# EAGLE design Circuit (EAGLE 9.6.2)
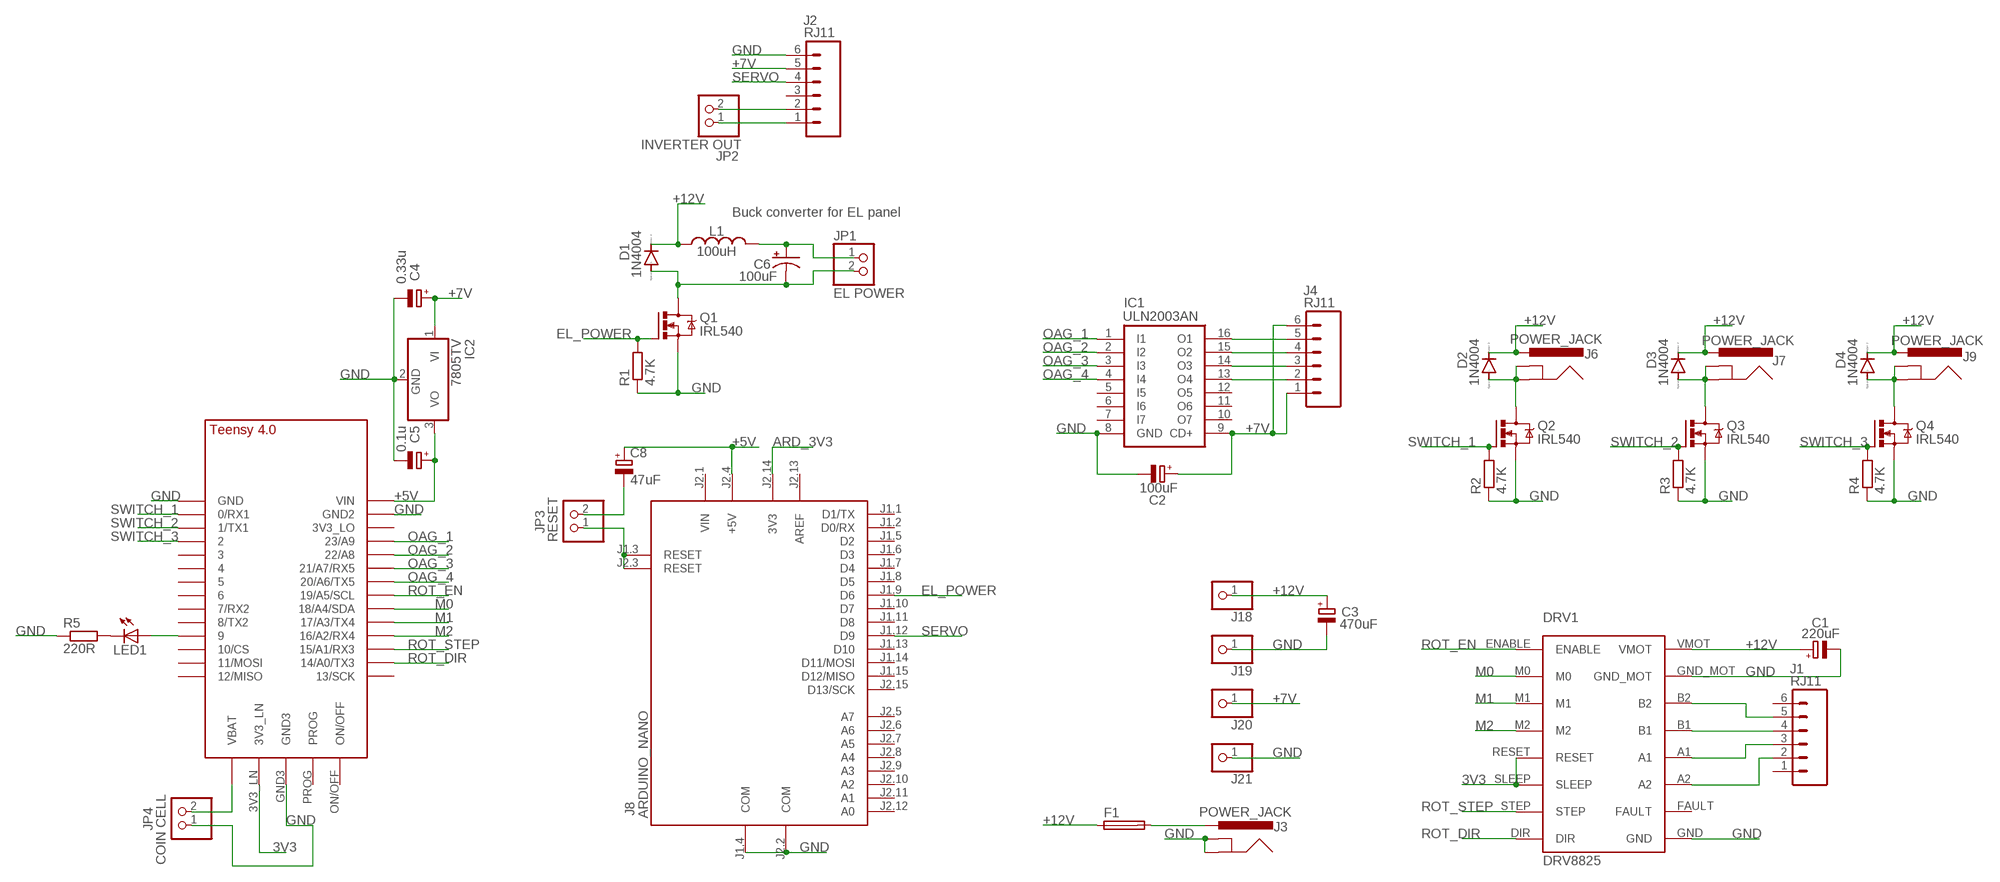
[diagram p0: schematic, sheet 1]

## Parts
C1  220uF  CPOL-EUE3.5-8  [E3,5-8]
C2  100uF  CPOL-EUE2.5-6  [E2,5-6]
C3  470uF  CPOL-EUE3.5-8  [E3,5-8]
C4  0.33u  CPOL-EUE1.8-4  [E1,8-4]
C5  0.1u  CPOL-EUE1.8-4  [E1,8-4]
C6  100uF  CPOL-USE2.5-7  [E2,5-7]
C8  47uF  CPOL-EUE2,5-6E  [E2,5-6E]
D1  1N4004  [DO41-10]
D2  1N4004  [DO41-10]
D3  1N4004  [DO41-10]
D4  1N4004  [DO41-10]
DRV1  DRV8825  [DRV8825]
F1  SH22,5  [SH22,5]
IC1  ULN2003AN  [DIL16]
IC2  7805TV  [TO220V]
J1  RJ11  RJ11-6  [RJ11-6]
J2  RJ11  RJ11-6  [RJ11-6]
J3  POWER_JACK  [POWER_JACK_PTH]
J4  RJ11  RJ11-6  [RJ11-6]
J6  POWER_JACK  [POWER_JACK_PTH]
J7  POWER_JACK  [POWER_JACK_PTH]
J8  ARDUINO_NANO  ARDUINO_NANO2  [ARDUINO_NANO2]
J9  POWER_JACK  [POWER_JACK_PTH]
J18  PINHD-1X1  [1X01]
J19  PINHD-1X1  [1X01]
J20  PINHD-1X1  [1X01]
J21  PINHD-1X1  [1X01]
JP1  EL POWER  PINHD-1X2  [1X02]
JP2  INVERTER OUT  PINHD-1X2  [1X02]
JP3  RESET  PINHD-1X2  [1X02]
JP4  COIN CELL  PINHD-1X2  [1X02]
L1  100uH  L-US6000-XXX-RC  [6000-XXXX-RC]
LED1  LED3MM  [LED3MM]
Q1  IRL540  IRF540  [TO220BV]
Q2  IRL540  IRF540  [TO220BV]
Q3  IRL540  IRF540  [TO220BV]
Q4  IRL540  IRF540  [TO220BV]
R1  4.7K  R-EU_0204/7  [0204/7]
R2  4.7K  R-EU_0204/7  [0204/7]
R3  4.7K  R-EU_0204/7  [0204/7]
R4  4.7K  R-EU_0204/7  [0204/7]
R5  220R  R-EU_0204/5  [0204/5]
U$1  TEENSY_4.0-BASIC  [TEENSY_4.0-BASIC]

## Nets
3V3: DRV1.RESET DRV1.SLEEP U$1.3V3_LN
+5V: C5.+ C8.+ IC2.3(VO) J8.J2.4(+5V) U$1.VIN
+7V: C2.+ C4.+ IC1.9(CD+) IC2.1(VI) J2.5 J4.1 J4.6 J20.1
+12V: C1.+ C3.+ D1.C D2.C D3.C D4.C DRV1.VMOT F1.1 J6.PWR J7.PWR J9.PWR J18.1 L1.1
ARD_3V3: J8.J2.14(3V3)
EL_POWER: J8.J1.9(D6) Q1.G R1.2
GND: C1.- C2.- C3.- C4.- C5.- DRV1.GND DRV1.GND_MOT IC1.8(GND) IC2.2(GND) J2.6 J3.GND J3.GNDBREAK J8.J1.4(COM) J8.J2.2(COM) J19.1 J21.1 JP4.1 Q1.S Q2.S Q3.S Q4.S R1.1 R2.1 R3.1 R4.1 R5.1 U$1.GND U$1.GND2 U$1.GND3
M0: DRV1.M0 U$1.18/A4/SDA
M1: DRV1.M1 U$1.17/A3(17/A3/TX4)
M2: DRV1.M2 U$1.16/A2(16/A2/RX4)
N$1: DRV1.B1 J1.4
N$2: D3.A J7.GND J7.GNDBREAK Q3.D
N$3: C6.- D1.A JP1.2 Q1.D
N$4: D4.A J9.GND J9.GNDBREAK Q4.D
N$5: D2.A J6.GND J6.GNDBREAK Q2.D
N$6: DRV1.B2 J1.5
N$7: IC1.16(O1) J4.5
N$8: DRV1.A1 J1.3
N$9: DRV1.A2 J1.2
N$10: LED1.A U$1.9/CS
N$11: LED1.K(C) R5.2
N$12: C6.+ JP1.1 L1.2
N$13: J2.1 JP2.1
N$14: J2.2 JP2.2
N$15: JP4.2 U$1.VBAT\(VBAT)
N$16: IC1.15(O2) J4.4
N$17: IC1.14(O3) J4.3
N$18: IC1.13(O4) J4.2
N$19: J8.J1.3(RESET) J8.J2.3(RESET) JP3.1
N$23: C8.- JP3.2
N$25: F1.2 J3.PWR
OAG_1: IC1.1(I1) U$1.23/A9
OAG_2: IC1.2(I2) U$1.22/A8
OAG_3: IC1.3(I3) U$1.21/A7(21/A7/RX5)
OAG_4: IC1.4(I4) U$1.20/A6(20/A6/TX5)
ROT_DIR: DRV1.DIR U$1.14/A0(14/A0/TX3)
ROT_EN: DRV1.ENABLE U$1.19/A5/SCL
ROT_STEP: DRV1.STEP U$1.15/A1(15/A1/RX3)
SERVO: J2.4 J8.J1.12(D9)
SWITCH_1: Q2.G R2.2 U$1.0/RX(0/RX1)
SWITCH_2: Q3.G R3.2 U$1.1/TX(1/TX1)
SWITCH_3: Q4.G R4.2 U$1.2
Unconnected: DRV1.FAULT IC1.5(I5) IC1.6(I6) IC1.7(I7) IC1.10(O7) IC1.11(O6) IC1.12(O5) J1.1 J1.6 J2.3 J8.J1.1(D1/TX) J8.J1.2(D0/RX) J8.J1.5(D2) J8.J1.6(D3) J8.J1.7(D4) J8.J1.8(D5) J8.J1.10(D7) J8.J1.11(D8) J8.J1.13(D10) J8.J1.14(D11/MOSI) J8.J1.15(D12/MISO) J8.J2.5(A7) J8.J2.6(A6) J8.J2.7(A5) J8.J2.8(A4) J8.J2.9(A3) J8.J2.10(A2) J8.J2.11(A1) J8.J2.12(A0) J8.J2.15(D13/SCK) U$1.3/CANTX U$1.3V3_LO U$1.4/CANRX U$1.5 U$1.6 U$1.7(7/RX2) U$1.8(8/TX2) U$1.10/CS U$1.11/MOSI U$1.12/MISO U$1.13/SCK U$1.ON/OFF U$1.PROG

## Notes on the sheet
- Buck converter for EL panel

## Power pins joined to a net without a drawn wire
AREF: J8.J2.13(AREF)
VIN: J8.J2.1(VIN)

## Library data of the parts
C1-C5 C8 = rcl:CPOL-EU: POLARIZED CAPACITOR, European symbol; SPICEPREFIX: C
C6 = rcl:CPOL-US: POLARIZED CAPACITOR, American symbol; SPICEPREFIX: C
D1-D4 = diode:1N4004: DIODE general purpose rectifier, 1 A
DRV1 = DRV8825:DRV8825: DRV8825 Stepper motor driver
F1 = fuse:SH22,5: FUSE HOLDER grid 22,5 mm, OGN0031 8201, Schurter (Buerklin); MF: SCHURTER; MPN: 0031.8201; OC_FARNELL: 1162740; OC_NEWARK: 96F8317
IC1 = uln-udn:ULN2003A: DRIVER ARRAY
IC2 = linear:78*: Positive VOLTAGE REGULATOR Source: http://cache.national.com/ds/LM/LM78L05.pdf http://www.fairchildsemi.com/ds/LM/LM7805.pdf
J1 J2 J4 = SparkFun-Connectors:RJ11-6: RJ11 Jack - 6 pin Commonly found on CAT3 devices and some Microchip programmers. Here is the connector we sell at SparkFun: RJ11 6-Pin Connector <https://www.sparkfun.com/products/132> (PRT-00132) Datasheet <http://www.sparkfun.com/datasheets/Prototyping/Connectors/RJ11-Datasheet.pdf> It is used on this SparkFun product: SparkFun Weather Shield <https://www.sparkfun.com/products/12081> (DEV-12081) Weather Meters <https://www.sparkfun.com/products/8942> (SEN-08942); PROD_ID: CONN-08590; SF_ID: PRT-00132
J3 J6 J7 J9 = SparkFun-Connectors:POWER_JACK: Power Jack Connector This is the standard 5.5mm barrel jack for power. The PTH is the most common, proven, reliable, footprint. The Slot footprint only works if the mill layer is transmitted to the PCB fab house so be warned. Here are the connectors we sell at SparkFun: DC Barrel Power Jack/Connector <https://www.sparkfun.com/products/119> (PRT-00119) DC Barrel Power Jack/Connector (SMD) <https://www.sparkfun.com/products/12748> (PRT-12748) DC Barrel Jack Adapter - Breadboard Compatible <https://www.sparkfun.com/products/10811> (PRT-10811) It is used on this SparkFun product (and many, many others): SparkFun RedBoard - Programmed with Arduino <https://www.sparkfun.com/products/12757> (DEV-12757) Also, if you need a mating power supply or connector, please check these out: Wall Adapter Power Supply - 9VDC 650mA <https://www.sparkfun.com/products/298> (TOL-00298) DC Barrel Jack Adapter - Male <https://www.sparkfun.com/products/10287> (PRT-10287); PROD_ID: CONN-08197
J8 = arduino:ARDUINO_NANO2: Arduino Nano2 Auto generated by modulcreator.ulp \;; ANZAHL: 2; MODUL: TRUE; STECKX0: -76200; STECKX1: 76200; STECKY0: 177800; STECKY1: 177800
J18-J21 = pinhead:PINHD-1X1: PIN HEADER
JP1-JP4 = pinhead:PINHD-1X2: PIN HEADER
L1 = rcl:L-US: INDUCTOR, American symbol; SPICEPREFIX: L
LED1 = adafruit:LED: LED OSRAM: - CHIPLED LG R971, LG N971, LY N971, LG Q971, LY Q971, LO R971, LY R971 LH N974, LH R974 LS Q976, LO Q976, LY Q976 LO Q996 - Hyper CHIPLED LW Q18S LB Q993, LB Q99A, LB R99A - SideLED LS A670, LO A670, LY A670, LG A670, LP A670 LB A673, LV A673, LT A673, LW A673 LH A674 LY A675 LS A676, LA A676, LO A676, LY A676, LW A676 LS A679, LY A679, LG A679 - Hyper Micro SIDELED® LS Y876, LA Y876, LO Y876, LY Y876 LT Y87S - SmartLED LW L88C, LW L88S LB L89C, LB L89S, LG L890 LS L89K, LO L89K, LY L89K LS L896, LA L896, LO L896, LY L896 - TOPLED LS T670, LO T670, LY T670, LG T670, LP T670 LSG T670, LSP T670, LSY T670, LOP T670, LYG T670 LG T671, LOG T671, LSG T671 LB T673, LV T673, LT T673, LW T673 LH T674 LS T676, LA T676, LO T676, LY T676, LB T676, LH T676, LSB T676, LW T676 LB T67C, LV T67C, LT T67C, LS T67K, LO T67K, LY T67K, LW E67C LS E67B, LA E67B, LO E67B, LY E67B, LB E67C, LV E67C, LT E67C LW T67C LS T679, LY T679, LG T679 LS T770, LO T770, LY T770, LG T770, LP T770 LB T773, LV T773, LT T773, LW T773 LH T774 LS E675, LA E675, LY E675, LS T675 LS T776, LA T776, LO T776, LY T776, LB T776 LHGB T686 LT T68C, LB T68C - Hyper Mini TOPLED® LB M676 - Mini TOPLED Santana® LG M470 LS M47K, LO M47K, LY M47K Source: http://www.osram.convergy.de/
Q1-Q4 = transistor-power:IRF540: HEXFET Power MOSFET
R1-R4 = resistor:R-EU_: RESISTOR, European symbol
R5 = rcl:R-EU_: RESISTOR, European symbol; SPICEPREFIX: R
U$1 = Teensy-4.0:TEENSY_4.0-BASIC

## Board
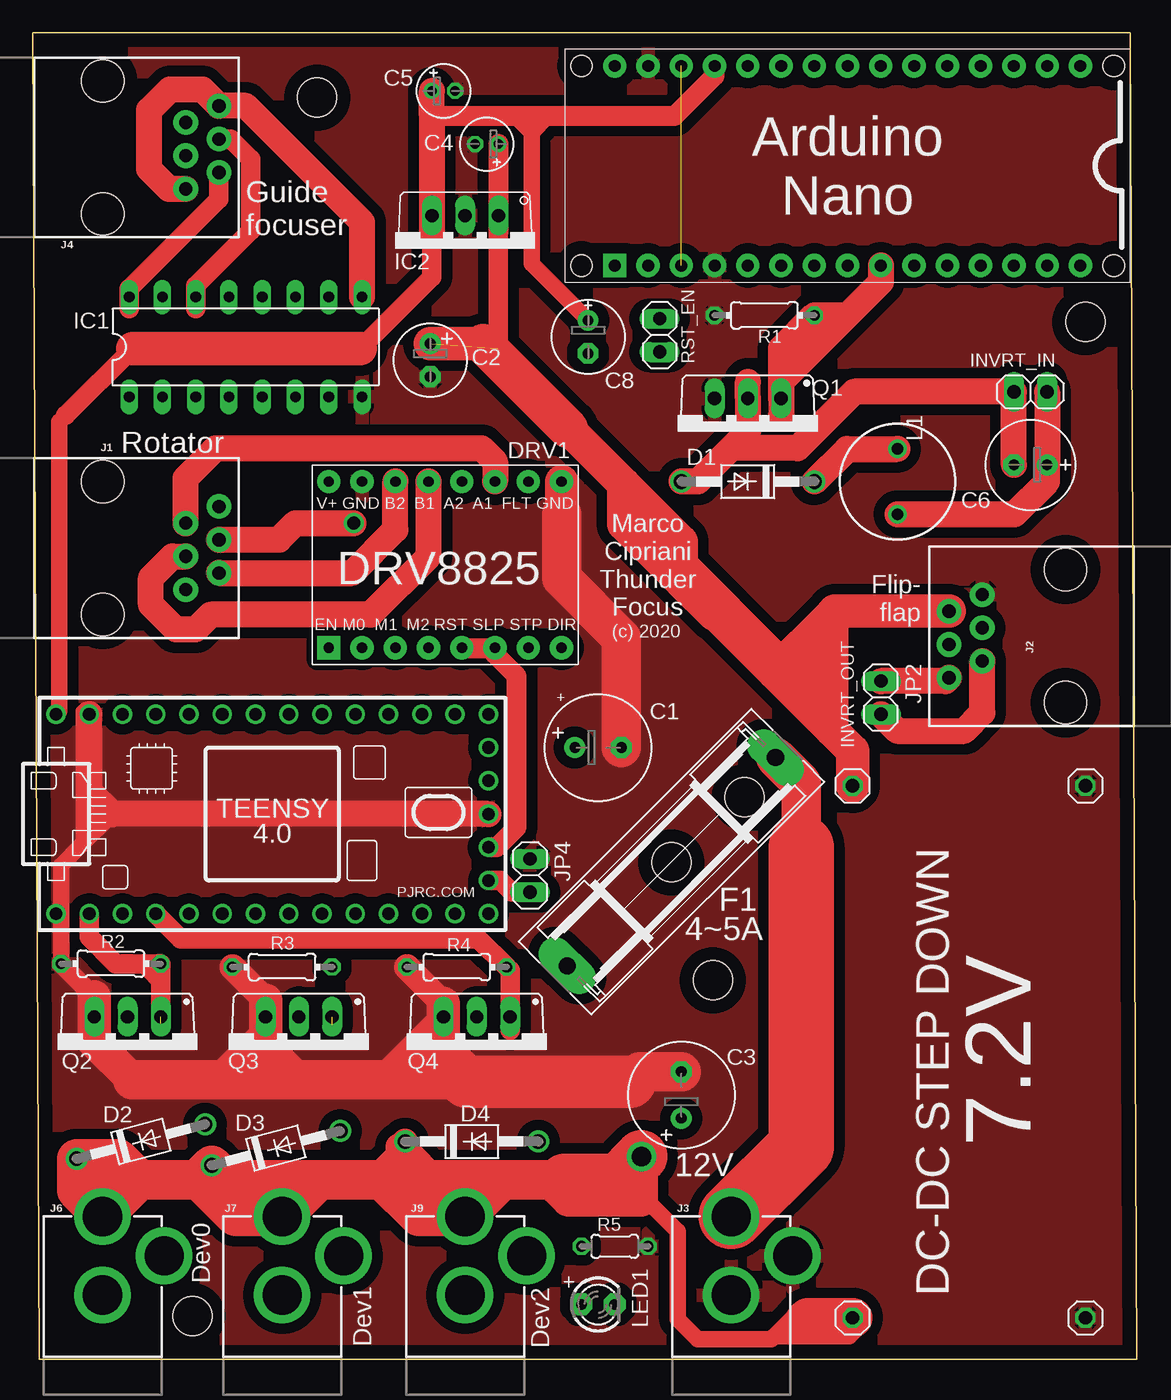
[diagram p1: board, top side]
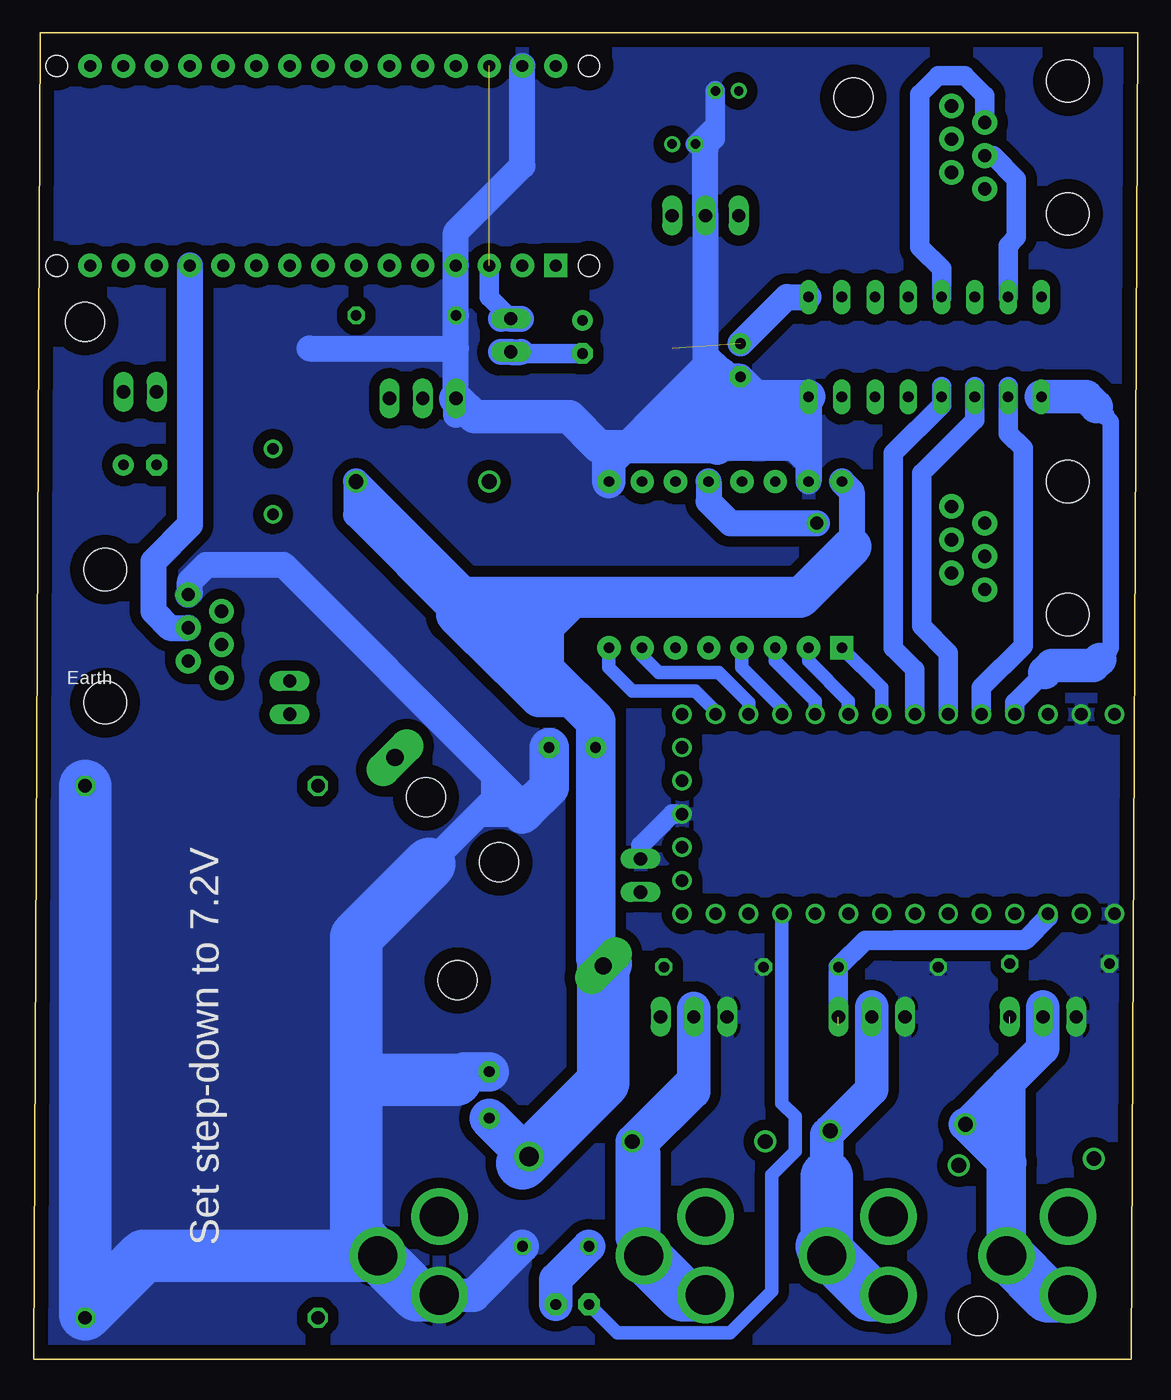
[diagram p2: board, bottom side, seen from below]

Size 84.33 x 101.35 mm. Coordinates in mm from the lower left corner, seen from the top.
Outline: 0,101.35 83.82,101.35 84.33,0 0.51,0 0,101.35
Copper layers (1*16): Top 0.035mm / dielectric 1.5mm / Bottom 0.035mm
Design rules "default": minimum track width 6mil, minimum drill 0.35mm, track to track 6mil, track to pad 6mil, pad to pad 6mil, via to via 6mil, smd to smd 6mil, copper to edge 40mil, drill to drill 6mil, minimum pad ring 10mil, minimum via ring 8mil, stop-mask expansion 4mil, vias tented up to drill 0mil, thermal gap 10mil
Holes 3 mm at 21.72,96.39 12.19,3.3 80.39,79.25 54.36,42.93 51.94,28.96 48.77,37.97

### Footprints (pad centres in the part's own frame; a part is rotated, then mirrored left to right if it is on the bottom)
E3,5-8 = drill 0.813 pad 1.6: + -1.778,0 | drill 0.813 pad 1.6 octagon: - 1.778,0
E2,5-6 = drill 0.813 pad 1.6: + -1.27,0 | drill 0.813 pad 1.6 octagon: - 1.27,0
E1,8-4 = drill 0.711 pad 1.168: + -0.889,0 | drill 0.711 pad 1.168 octagon: - 0.889,0
E2,5-7 = drill 0.813 pad 1.6: + -1.27,0 | drill 0.813 pad 1.6 octagon: - 1.27,0
E2,5-6E = drill 0.813 pad 1.575: + -1.27,0 | drill 0.813 pad 1.575 octagon: - 1.27,0
DO41-10 = drill 1.118: A 5.08,0; C -5.08,0
DRV8825 = drill 0.8 pad 1.778: A1 13.97,-11.43; A2 13.97,-13.97; B1 13.97,-8.89; B2 13.97,-6.35; DIR 1.27,-19.05; FAULT 13.97,-16.51; GND 13.97,-19.05; GND_MOT 13.97,-3.81; M0 1.27,-3.81; M1 1.27,-6.35; M2 1.27,-8.89; RESET 1.27,-11.43; SLEEP 1.27,-13.97; STEP 1.27,-16.51; VMOT 13.97,-1.27 | drill 0.8 pad 1.778 square: ENABLE 1.27,-1.27
SH22,5 = drill 1.321 pad 2.54 long: 1 -11.252,0; 2 11.252,0
DIL16 = drill 0.813 long: 1 -8.89,-3.81; 2 -6.35,-3.81; 3 -3.81,-3.81; 4 -1.27,-3.81; 5 1.27,-3.81; 6 3.81,-3.81; 7 6.35,-3.81; 8 8.89,-3.81; 9 8.89,3.81; 10 6.35,3.81; 11 3.81,3.81; 12 1.27,3.81; 13 -1.27,3.81; 14 -3.81,3.81; 15 -6.35,3.81; 16 -8.89,3.81
TO220V = drill 1.016 long: 1 -2.54,-2.54; 2 0,-2.54; 3 2.54,-2.54
RJ11-6 = drill 1.016 pad 1.88: 1 -3.175,8.89; 2 -1.905,6.35; 3 -0.635,8.89; 4 0.635,6.35; 5 1.905,8.89; 6 3.175,6.35 | hole 3.251: -5.08,0; 5.08,0
POWER_JACK_PTH = drill 2.997 pad 4.318: GND 0,7.7; GNDBREAK 4.7,10.7; PWR 0,13.7
ARDUINO_NANO2 = drill 0.914 pad 1.778 square: J1.1 -7.62,17.78 | drill 0.914 pad 1.778: J1.2 -7.62,15.24; J1.3 -7.62,12.7; J1.4 -7.62,10.16; J1.5 -7.62,7.62; J1.6 -7.62,5.08; J1.7 -7.62,2.54; J1.8 -7.62,0; J1.9 -7.62,-2.54; J1.10 -7.62,-5.08; J1.11 -7.62,-7.62; J1.12 -7.62,-10.16; J1.13 -7.62,-12.7; J1.14 -7.62,-15.24; J1.15 -7.62,-17.78; J2.1 7.62,17.78; J2.2 7.62,15.24; J2.3 7.62,12.7; J2.4 7.62,10.16; J2.5 7.62,7.62; J2.6 7.62,5.08; J2.7 7.62,2.54; J2.8 7.62,0; J2.9 7.62,-2.54; J2.10 7.62,-5.08; J2.11 7.62,-7.62; J2.12 7.62,-10.16; J2.13 7.62,-12.7; J2.14 7.62,-15.24; J2.15 7.62,-17.78 | hole 1.651: -7.62,-20.32; 7.62,-20.32; 7.62,20.32; -7.62,20.32
1X01 = drill 1.016 octagon: 1 0,0
1X02 = drill 1.016 long: 1 -1.27,0; 2 1.27,0
6000-XXXX-RC = drill 0.9 pad 1.422: 1 -2.5,0; 2 2.5,0
LED3MM = drill 0.813 pad 1.676 octagon: A -1.27,0; K 1.27,0
TO220BV = drill 1.016 long: D 0,-2.54; G -2.54,-2.54; S 2.54,-2.54
0204/7 = drill 0.813 octagon: 1 -3.81,0; 2 3.81,0
0204/5 = drill 0.813 octagon: 1 -2.54,0; 2 2.54,0
TEENSY_4.0-BASIC = drill 0.965: 0/RX -13.97,-7.62; 1/TX -11.43,-7.62; 2 -8.89,-7.62; 3/CANTX -6.35,-7.62; 3V3_LN 16.51,-2.54; 3V3_LO -11.43,7.62; 4/CANRX -3.81,-7.62; 5 -1.27,-7.62; 6 1.27,-7.62; 7 3.81,-7.62; 8 6.35,-7.62; 9/CS 8.89,-7.62; 10/CS 11.43,-7.62; 11/MOSI 13.97,-7.62; 12/MISO 16.51,-7.62; 13/SCK 16.51,7.62; 14/A0 13.97,7.62; 15/A1 11.43,7.62; 16/A2 8.89,7.62; 17/A3 6.35,7.62; 18/A4/SDA 3.81,7.62; 19/A5/SCL 1.27,7.62; 20/A6 -1.27,7.62; 21/A7 -3.81,7.62; 22/A8 -6.35,7.62; 23/A9 -8.89,7.62; GND -16.51,-7.62; GND2 -13.97,7.62; GND3 16.51,0; ON/OFF 16.51,5.08; PROG 16.51,2.54; VBAT\ 16.51,-5.08; VIN -16.51,7.62

### Placement (x,y rotation side)
C1  43.18,46.74 0 top
C2  30.35,76.33 270 top
C3  49.53,20.19 90 top
C4  34.67,92.84 180 top
C5  31.37,96.9 0 top
C6  76.2,68.33 180 top
C8  42.42,78.1 270 top
D1  54.61,67.06 180 top
D2  8.26,16.64 15 top
D3  18.57,16.13 15 top
D4  33.53,16.64 0 top
DRV1  21.34,53.09 90 top
F1  48.78,38.02 45 top
IC1  16.26,77.34 0 top
IC2  33.02,84.84 180 top
J1  5.33,61.98 270 top
J2  78.87,55.25 90 top
J3  53.34,-2.79 0 top
J4  5.33,92.58 270 top
J6  5.33,-2.79 0 top
J7  19.05,-2.79 0 top
J8  62.23,91.19 90 top
J9  33.02,-2.79 0 top
J18  62.61,3.17 90 top
J19  80.39,3.17 90 top
J20  62.61,43.82 90 top
J21  80.39,43.82 90 top
JP1  76.2,73.91 180 top
JP2  64.77,50.55 270 top
JP3  47.88,78.23 270 top
JP4  37.97,36.96 270 top
L1  66.04,67.06 270 top
LED1  43.18,4.19 0 top
Q1  54.61,70.87 180 top
Q2  7.24,23.62 180 top
Q3  20.32,23.62 180 top
Q4  33.91,23.62 180 top
R1  55.88,79.76 0 top
R2  5.97,30.23 0 top
R3  19.05,29.97 0 top
R4  32.38,29.97 0 top
R5  44.45,8.64 180 top
U$1  18.29,41.66 0 top

### Tracks (layer width: path | path; a pad name or v marks a point on that pad's centre or on a via)
3V3
  Top 1.53: DRV1.RESET DRV1.SLEEP 35.31,53.85 36.96,52.2 36.96,40.64 35.43,39.12 U$1.3V3_LN
+5V
  Top 1.27: U$1.VIN 2.03,49.53 2.03,71.63 2.54,72.14 | C8.+ 38.1,83.69 38.1,93.73 | 38.1,95 38.1,93.73 | 36.83,95 38.1,93.73 | 38.1,93.73 39.37,95
  Top 1.5: IC2.3 30.48,82.68 25.02,77.22 | 7.62,77.22 2.54,72.14
  Top 1.53: 30.48,95 36.83,95 38.1,95 39.37,95 49.02,95 52.07,98.04 J8.J2.4
  Top 2: C5.+ 30.48,95 IC2.3 30.48,86.11
  Top 2.54: 25.02,77.22 7.62,77.22
+7V  (1 unrouted)
  Top 1.5: IC2.1 35.56,77.22 | 45.15,66.87 45.15,66.48
  Top 1.53: C4.+ IC2.1 35.56,86.11
  Top 2: IC1.9 25.15,86.87 16.26,95.76 J4.1 12.95,97.03 10.48,97.03 8.89,95.43 8.89,90.93 10.41,89.41 J4.6 | 56.64,52.53 56.64,52.45 56.52,52.45
  Top 2.54: 40.89,71.12 45.15,66.87 49.53,62.48 49.53,60.71 | C2.+ 34.42,77.6 | 49.53,59.56 49.53,59.44 | 49.53,59.44 52.07,56.9 | 61.02,48.07 62.61,46.48 J20.1 | 61.02,48.07 56.64,52.45 49.53,59.56 | 49.53,60.71 49.53,59.56 | J2.5 61.26,57.15 61.02,56.91 | 61.02,56.91 56.64,52.53 56.64,53.59 49.53,60.71 | 61.02,48.07 61.02,53.09 | 61.02,53.09 61.02,56.91 | 61.02,53.09 59.75,51.82 58.42,51.82 58.42,53.09 59.69,53.09 | 45.15,66.48 45.15,63.82 49.53,59.44
  Top 3: 34.42,77.6 40.89,71.12
  Bottom 2: C2.+ 26.8,81.15 IC1.9
+12V  (via drill 1.5)
  Top 1.016: J9.PWR 33.02,11.18 30.48,13.72 | 29.21,14.99 28.45,15.75 27.94,16.26 25.4,13.72 | 25.53,13.72 D4.C 28.56,16.64 31.48,13.72
  Top 1.27: 57.78,1.78 59.18,3.17 58.04,3.17 56.64,1.78 | 56.64,1.78 57.78,1.78 | 57.78,1.78 61.21,1.78 | J18.1 61.21,1.78 | 61.21,1.78 62.36,1.78 63.37,2.79 | 46.48,12.19 46.86,12.19 49.28,9.78 49.28,3.05 50.8,1.52 56.39,1.52 56.64,1.78
  Top 2: 27.94,14.99 27.94,16.26 | D4.C 28.45,15.75 | D1.C 62.19,69.56 L1.1
  Top 2.54: v46.48,15.49 46.48,12.19 40.89,12.19 40.01,13.08
  Top 3: 5.08,13.59 D2.C | J7.PWR 17.58,10.91 D3.C 12.7,13.85 12.7,13.72 | 30.21,13.72 26.67,13.72 | 26.67,13.72 25.53,13.72 25.4,13.72 21.86,13.72 | 5.21,13.72 5.08,13.59 | 21.86,13.72 12.7,13.72 | 8.02,13.59 J6.PWR 3.35,12.89 D2.C | 30.21,13.72 30.48,13.72 31.48,13.72 35.83,13.72 | J9.PWR 30.21,13.72 | J9.PWR 35.83,13.72 | J9.PWR 29.48,10.91 26.67,13.72 | J7.PWR 15.51,10.91 12.7,13.72 | J7.PWR 21.86,13.72 | 7.89,13.72 8.14,13.72 | 8.14,13.72 12.7,13.72 | 40.64,13.72 35.83,13.72 | 8.14,13.72 8.02,13.59 | 8.02,13.59 5.08,13.59 | 8.14,13.72 6.54,15.32 D2.C | J18.1 59.18,3.17 58.93,2.92
  Top 4: v46.48,15.49 44.7,13.72 40.64,13.72
  Bottom 1.27: 52.7,56.26 52.07,56.9 50.8,58.17 49.53,58.17 | 41.91,58.17 44.45,55.63 44.45,51.82 43.18,50.55 41.91,49.28
  Bottom 2: DRV1.VMOT 21.84,66.29 21.84,62.1 | 51.44,58.8 D1.C 59.69,64.52 52.07,56.9 | 51.44,58.8 46.99,54.36 | 51.44,58.8 26.42,58.8 25.78,58.17
  Bottom 2.54: 38.1,58.17 31.75,58.17 | 46.99,53.09 50.8,56.9 | 48.26,58.17 48.26,55.63
  Bottom 3: 43.56,58.17 45.85,55.88 45.85,51.82 | 43.56,58.17 41.91,58.17 31.75,58.17 25.78,58.17 21.84,62.1 | 43.56,58.17 48.26,58.17 49.53,58.17 50.8,56.9 | C3.+ 46.61,15.49 v46.48,15.49 | 43.18,50.55 41.4,48.77 C1.+ 41.4,30.64 F1.1 | 46.99,54.36 43.18,50.55 | 52.07,56.9 50.16,54.99 45.72,50.55 43.18,50.55
  Bottom 4: 46.99,14.99 v46.48,15.49 40.82,21.15 F1.1 40.64,30.24
EL_POWER
  Top 2: Q1.G 57.15,77.22 R1.2 62.23,79.76 | J8.J1.9 64.77,82.3 62.23,79.76 | Q1.G 57.15,74.68 62.23,79.76 | Q1.G 57.15,72.14
GND
  Top 0.813: 3.68,39.24 3.68,48.64 | 3.68,48.64 U$1.GND2 | 4.32,48.01 3.68,48.64 | 3.68,48.64 3.68,49.53 3.94,49.78 4.19,49.78
  Top 1.27: 6.1,41.66 3.68,39.24 2.16,37.72 2.16,34.42 U$1.GND 1.91,34.04 2.16,34.29 R2.1
  Top 1.5: R2.1 4.7,27.69 4.7,25.15
  Top 2: 12.7,21.34 12.32,21.34 | U$1.GND3 6.1,41.66 4.32,43.43 | U$1.GND2 4.32,48.01 4.32,43.43 | 4.32,43.43 4.32,40.89 | 31.37,27.18 R4.1 | 31.75,23.88 31.75,22.61 | Q4.S 26.8,21.59 26.8,21.34 | 29.21,21.34 29.21,22.61 30.48,23.88 31.11,23.24 | 31.37,24.26 31.75,23.88 | 31.75,23.88 34.29,21.34 | Q2.S 4.7,25.15 4.7,24.26 | R3.1 17.78,27.43 17.78,23.88 17.78,22.61 | Q3.S 17.78,25.15 13.97,21.34 | 16.51,21.34 16.51,22.61
  Top 2.3: 17.78,21.34 19.05,21.34 | 31.75,21.34 33.02,21.34
  Top 2.54: 20.32,21.34 19.05,21.34 16.51,21.34 13.97,21.34 12.32,21.34 7.62,21.34 4.7,24.26 Q2.S 4.7,27.69 | 20.32,21.34 26.8,21.34 29.21,21.34 33.02,21.34 34.29,21.34 | 40.39,64.52 DRV1.GND | 17.78,22.61 Q3.S 17.78,27.43 | 17.78,23.88 20.32,21.34 | 31.37,27.18 Q4.S 31.37,24.26
  Top 3: 40.39,64.52 40.39,59.69 44.96,55.12 C1.- | 33.02,21.34 20.32,21.34 7.62,21.34 | C3.- 46.35,21.97 45.59,21.21
  Top 4: 45.59,21.21 33.15,21.21 33.02,21.34
  Bottom 1.5: 32.26,94.36 C4.- 33.4,92.84 33.02,92.46 32.26,93.22 32.26,94.36 | C5.- 32.26,94.36 | U$1.GND3 35.56,41.66 37.97,39.24 JP4.1
  Bottom 2: 30.86,70.87 30.86,73.41 30.35,73.41 | 30.35,73.41 C2.- | 30.86,70.87 29.59,72.14 28.32,70.87 27.94,70.87 27.94,73.28 28.19,73.53 IC1.8 DRV1.GND_MOT 25.15,68.45 26.29,69.6 32.13,69.6 | 30.86,70.87 32,69.72 | 26.67,73.53 26.67,70.87 | C2.- 28.83,73.53 | J3.GND 52.91,4.91 | 52.07,77.22 Q1.S 52.07,72.14 | 52.07,77.22 R1.1 J8.J1.4 52.07,86.11 46.99,91.19 J8.J2.2 | IC2.2 33.02,86.11 | DRV1.GND 40.64,67.31 40.64,68.33 34.92,74.04 | IC2.2 33.02,76.71 | 63.25,77.22 52.07,77.22 | 49.15,44.58 65.28,60.71 71.12,60.71 72.39,59.44 72.39,58.55 J2.6 | 49.15,44.58 46.61,42.04 | C2.- 31.24,75.06 31.75,75.56 31.75,75.44 | 33.02,76.71 31.75,75.44 | 33.02,76.71 33.02,75.95 34.29,74.68 | 34.29,74.68 34.92,74.04 | 31.75,75.44 31.75,70.87 33.02,70.87 33.02,74.68 34.29,74.68 | 34.92,74.04 34.92,71.5 35.56,70.87 34.92,70.23 34.29,70.87 | 30.35,73.41 29.21,73.41 | IC2.2 33.02,92.46 | 54.1,37.85 50.29,41.66 | 50.29,41.66 46.99,41.66 | 50.29,41.66 49.15,42.8 49.15,44.58
  Bottom 2.54: 32,69.72 32.13,69.6 | 32,69.72 39.24,69.72 | 39.24,69.72 41.15,69.72 43.43,72.01 50.67,72.01 Q1.S | 39.24,69.72 40.39,68.58 DRV1.GND | IC1.8 26.67,73.53 28.19,73.53 | 28.19,73.53 28.83,73.53 | 28.19,73.53 32,69.72 | J19.1 80.39,3.43 | J3.GND 50.72,4.91 R5.1
  Bottom 3: 46.99,41.66 46.61,42.04 44.96,43.69 C1.- | 52.07,21.34 51.44,21.97 C3.-
  Bottom 4: J3.GND 55.04,4.91 J3.GNDBREAK | J3.GNDBREAK 75.91,7.91 80.39,3.43 J21.1 | 59.69,21.34 59.69,9.56 J3.GNDBREAK | 59.69,21.34 52.07,21.34 | 54.1,37.85 59.69,32.26 59.69,21.34
  pour Top (isolate 0.813): 0,101.35 0,-0.25 83.82,-0.25 83.82,101.35
  pour Bottom (isolate 0.813): 0,101.35 0,-0.25 85.09,-0.25 85.09,101.35
M0
  Bottom 1.016: DRV1.M0 25.15,53.34 22.1,50.29 U$1.18/A4/SDA
M1
  Bottom 1.016: DRV1.M1 27.69,53.34 24.64,50.29 U$1.17/A3
M2
  Bottom 1.016: U$1.16/A2 27.18,49.78 30.23,52.83 DRV1.M2
N$1
  Top 2: DRV1.B1 30.23,61.34 25.78,56.9 13.59,56.9 12.45,55.75 10.92,55.75 9.02,57.66 9.02,59.69 10.67,61.34 J1.4
N$2
  Bottom 2: J7.GNDBREAK 20.75,4.91 J7.GND
  Bottom 2.54: 23.75,13.97 23.75,17.18 D3.A 20.32,20.61 Q3.D 20.32,26.92
  Bottom 4: J7.GND 20.4,4.91 24.13,8.64 | J7.GNDBREAK 23.75,13.97
N$3
  Top 2: 54.61,74.68 Q1.D 54.61,70.87 53.34,69.6 | 53.34,69.6 50.8,67.06 D1.A | C6.- JP1.2 62.74,73.91 58.42,69.6 53.34,69.6
N$4
  Bottom 2.54: J9.GNDBREAK 37.72,14.99 | 37.72,14.99 37.72,15.75 D4.A | 38.61,9.27 D4.A | 33.91,21.34 Q4.D 33.91,26.8 | D4.A 33.91,21.34 | 33.91,21.34 33.91,20.45 38.1,16.26 38.1,15.37 37.72,14.99
  Bottom 4: J9.GND 34.72,4.91 J9.GNDBREAK
N$5
  Bottom 2.54: 9.78,14.99 9.78,15.08 9.84,15.14 | 9.84,21.14 7.24,23.75 Q2.D 7.24,26.92 | 10.03,20.95 13.04,17.95 D2.A 9.84,14.63 9.84,15.14 | 10.03,14.73 10.03,20.95 | 10.03,20.95 9.84,21.14 | 9.84,21.14 9.84,15.14
  Bottom 3: J6.GNDBREAK 10.03,14.73
  Bottom 4: J6.GND 5.41,4.83 6.86,4.83 9.94,7.91 J6.GNDBREAK
N$6
  Top 2: DRV1.B2 27.69,63.37 24.38,60.07 J1.5
N$7
  Top 1.5: J4.5 14.22,88.65 7.37,81.79 IC1.16 7.37,80.26
N$8  (via drill 1)
  Top 2: v24.51,63.88 20.07,63.88 18.8,62.61 J1.3
  Bottom 2: DRV1.A1 32.77,65.53 31.11,63.88 v24.51,63.88
N$9
  Top 2: DRV1.A2 35.31,68.58 34.29,69.6 13.97,69.6 11.68,67.31 J1.2
N$10
  Bottom 1.016: U$1.9/CS 27.18,19.56 26.16,18.54 26.16,15.88 27.94,14.1 27.94,5.21 31.11,2.03 39.75,2.03 LED1.A
N$11
  Bottom 2.54: R5.2 44.45,6.1 LED1.K
N$12
  Top 2: L1.2 74.97,64.56 77.47,67.06 C6.+ JP1.1
N$13
  Top 2: J2.1 69.72,51.82 JP2.1
N$14
  Top 2: JP2.2 66.04,48.01 71.12,48.01 72.52,49.4 J2.2
N$15
  Top 1.5: U$1.VBAT\ 35.69,36.58 36.58,35.69 JP4.2
N$16
  Bottom 1.5: IC1.15 9.91,85.09 9.27,85.72 9.27,90.17 11.05,91.95 J4.4
N$17
  Top 1.5: J4.3 15.11,93.22 16.64,91.69 16.64,86.23 12.45,82.04 IC1.14 12.45,80.26
N$18
  Bottom 1.5: J4.2 11.68,96.52 13.21,98.04 15.24,98.04 16.64,96.65 16.64,84.96 14.99,83.31 IC1.13
N$19  (1 unrouted)
  Bottom 1.5: J8.J1.3 49.53,81.15 JP3.1
  Bottom 2: 47.12,79.5 JP3.1 48.64,79.5
N$23
  Bottom 1.5: C8.- 47.75,76.83 JP3.2
  Bottom 2: 48.64,76.96 JP3.2 47.12,76.96
N$25
  Top 3: F1.2 58.67,44.03 58.67,39.12
  Top 5: 58.67,39.12 58.67,16.24 J3.PWR
OAG_1
  Bottom 1.27: 2.54,72.14 2.06,71.65 2.06,54.33 2.29,54.1
  Bottom 1.5: 7.11,52.45 9.4,50.16 U$1.23/A9 | 3.17,72.77 2.54,72.14 | 2.92,53.47 2.29,54.1
  Bottom 2.54: 7.11,52.45 6.58,52.98 3.4,52.98 2.92,53.47 | IC1.1 3.94,73.53 3.17,72.77
OAG_2
  Bottom 1.5: U$1.22/A8 11.94,51.31 8.76,54.48 8.76,69.6 9.91,70.74 IC1.2 9.91,74.3
OAG_3
  Bottom 1.5: U$1.21/A7 14.48,53.98 16.51,56.01 16.51,67.69 12.45,71.75 IC1.3 12.45,74.3
OAG_4
  Bottom 1.5: U$1.20/A6 17.02,52.71 18.67,54.36 18.67,69.21 14.99,72.9 IC1.4 14.99,74.3
ROT_DIR
  Bottom 1.016: DRV1.DIR 40.39,52.83 38.61,51.05 33.78,51.05 32.26,49.53 U$1.14/A0
ROT_EN
  Bottom 1.016: U$1.19/A5/SCL 19.56,51.31 DRV1.ENABLE
ROT_STEP
  Bottom 1.016: DRV1.STEP 37.85,53.72 36.58,52.45 32,52.45 29.72,50.16 U$1.15/A1
SERVO
  Bottom 2: J8.J1.12 72.39,63.75 75.18,60.96 75.18,57.15 73.91,55.88 J2.4
SWITCH_1  (1 unrouted)
  Top 1.5: U$1.0/RX 4.32,32.26 6.35,30.23 8.89,30.23 | 8.89,30.23 R2.2 9.78,28.96 | 9.78,28.96 9.78,25.65 | 8.89,30.23 8.89,29.84 9.78,28.96
SWITCH_2  (1 unrouted)
  Bottom 1.5: 17.78,32 20.83,32 R3.2 22.86,25.53
  Bottom 1.53: 18.54,32 17.78,32 8.64,32 6.86,33.78 U$1.1/TX
SWITCH_3
  Top 1.5: 11.3,32.13 34.04,32.13 R4.2 36.45,29.72 Q4.G 36.45,25.15
  Top 1.53: U$1.2 11.3,32.13

### Text on the board
tPlace: Dev0 | Dev1 | Dev2
tNames: Arduino / Nano | Guide / focuser | INVRT_IN | RST_EN | Rotator | V+ GND B2 B1 A2 A1 FLT GND | DRV8825 | Marco / Cipriani / Thunder / Focus | Flip- / flap | EN M0 M1 M2 RST SLP STP DIR | (c) 2020 | + | INVRT_OUT | 4~5A | 7.2V | 12V | DC-DC STEP DOWN
bNames: Earth | Set step-down to 7.2V